# Altium schematic sheet Indicator Light.SchDoc
size Tabloid; SheetNumber: 4; SheetTotal: 5
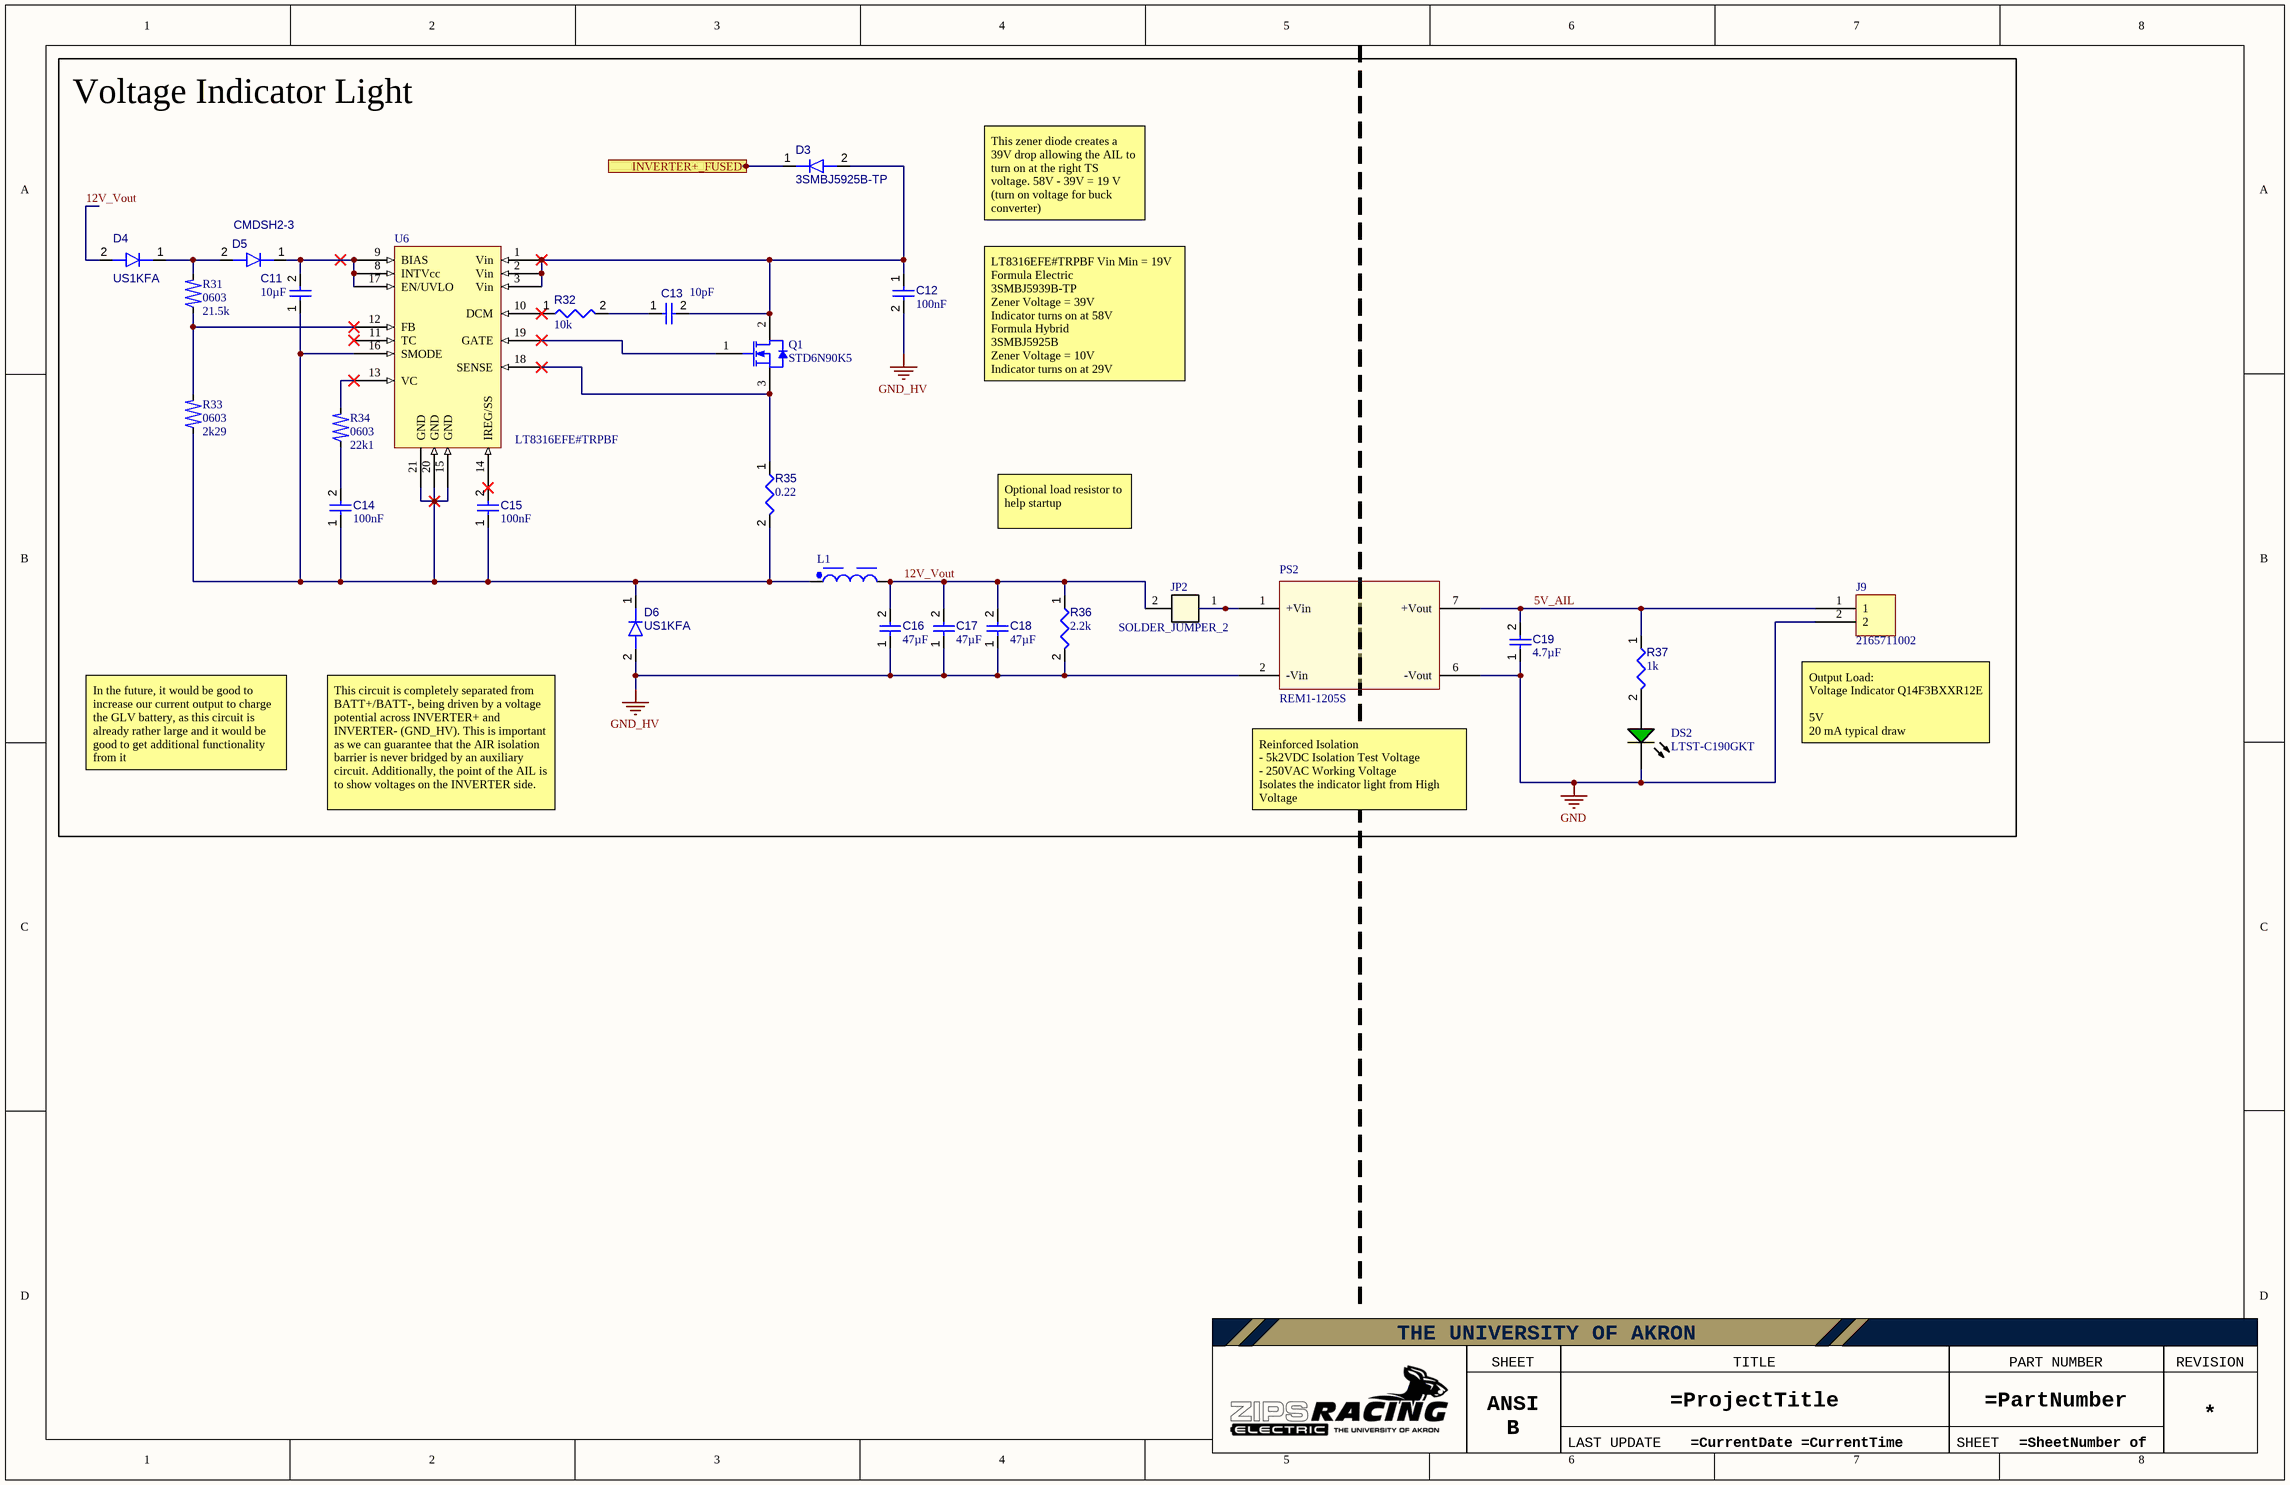
[diagram p0: Indicator Light.SchDoc]

## Parts
C11  value 10µF  [CAPC0805(2012)145_L]  (hidden comment: Capacitor 10µF +/-20% 25V 0805)
C12  value 100nF  [FP-GCJ55D-0_4-MFG]  (hidden comment: C1812C104KDRAC7800)
C13  value 10pF  [C1206C100FGGAC7800-Footprint-1]  (hidden comment: C1206C100FGGAC7800)
C14  value 100nF  [CAPC1608X90X40NL10T20]  (hidden comment: Capacitor 100 nF +/-10% 50 V 0603)
C15  value 100nF  [CAPC1608X90X40NL10T20]  (hidden comment: Capacitor 100 nF +/-10% 50 V 0603)
C16  value 47µF  [CAPC0805(2012)145_L]  (hidden comment: Capacitor 47µF +/-40% 6.3V 0805)
C17  value 47µF  [CAPC0805(2012)145_L]  (hidden comment: Capacitor 47µF +/-40% 6.3V 0805)
C18  value 47µF  [CAPC0805(2012)145_L]  (hidden comment: Capacitor 47µF +/-40% 6.3V 0805)
C19  value 4.7µF  [CAPC0805(2012)145_L]  (hidden comment: Capacitor 4.7µF +/-40% 25V 0805)
D3  3SMBJ5925B-TP  [SMBJ15A-Footprint-1]
D4  US1KFA  [DIOM2818X14N]
D5  CMDSH2-3  [CMDSH2-3-Footprint-1]
D6  US1KFA  [DIOM2818X14N]
DS2  LTST-C190GKT  [LTST-C190GKT_V]
J9  2165711002  [FP-216571-1002-MFG]
JP2  SOLDER_JUMPER_2  [C0603_JUMPER]  (no BOM)
L1  7687714102  [WE-PD HV_1060]  (value not drawn)
PS2  REM1-1205S  [REM1-1205S-Footprint-1]
Q1  STD6N90K5  [STD6N90K5-Footprint-1]
R31  value 21.5k  Footprint: 0603  [RES-0603-Generic]  (hidden comment: Resistor 21k5 0603 1%)
R32  value 10k  [RESC1608X55X25ML10T15]  (hidden comment: Resistor 10k +/-1% 0603 100 mW)
R33  value 2k29  Footprint: 0603  [RES-0603-Generic]  (hidden comment: Resistor 2k49 0603 1%)
R34  value 22k1  Footprint: 0603  [RES-0603-Generic]  (hidden comment: Resistor 22k1 0603 1%)
R35  value 0.22  [RESC3216X70X50NL05T20]  (hidden comment: ERJ-8BQFR22V)
R36  value 2.2k  [RESC1608X55X25LL10T15]  (hidden comment: Resistor 2.2k +/-1% 0603 100mW)
R37  value 1k  [RESC1608X55X25ML10T15]  (hidden comment: Resistor 1k +/-1% 0603 100 mW)
U6  LT8316EFE#TRPBF  [LT8316EFE#TRPBF-Footprint-1]

## Blocks framed on the sheet
Voltage Indicator Light: C11-C19 D3-D6 DS2 J9 JP2 L1 PS2 Q1 R31-R37 U6

## Ports
INVERTER+_FUSED (in, see Main[4C], High Voltage[1A], TS Precharge and TSAL[1A])

## Nets
GND: C19.1 DS2.2(K) J9.2 PS2.6(-Vout)
GND_HV: C12.2 C16.1 C17.1 C18.1 D6.2(A) PS2.2(-Vin) R36.2
5V_AIL: C19.2 J9.1 PS2.7(+Vout) R37.1
12V_Vout: C16.2 C17.2 C18.2 D4.2(A) JP2.2 L1.2 R36.1
INVERTER+_FUSED: D3.1(K) ; port INVERTER+_FUSED
NetC11_1: C11.1 C14.1 C15.1 D6.1(K) L1.1 R33.1 R35.2 U6.15(GND) U6.16(SMODE) U6.20(GND) U6.21(GND)
NetC11_2: C11.2 D5.1(K) U6.8(INTVcc) U6.9(BIAS) U6.17(EN/UVLO)
NetC12_1: C12.1 C13.2 D3.2(A) Q1.2(D) U6.1(Vin) U6.2(Vin) U6.3(Vin)
NetC13_1: C13.1 R32.2
NetC14_2: C14.2 R34.1
NetC15_2: C15.2 U6.14(IREG/SS)
NetD4_1: D4.1(K) D5.2(A) R31.2
NetDS2_1: DS2.1(A) R37.2
NetJP2_1: JP2.1 PS2.1(+Vin)
NetQ1_1: Q1.1(G) U6.19(GATE)
NetQ1_3: Q1.3(S) R35.1 U6.18(SENSE)
NetR31_1: R31.1 R33.2 U6.12(FB)
NetR32_1: R32.1 U6.10(DCM)
NetR34_2: R34.2 U6.13(VC)

Not connected (* = marked no-connect by the designer): PS2 3(NC) 4(NC) 5(NC); U6 11(TC)*

## Notes on the sheet
- This zener diode creates a 39V drop allowing the AIL to turn on at the right TS voltage. 58V - 39V = 19 V (turn on voltage for buck converter)
- LT8316EFE#TRPBF Vin Min = 19V
  Formula Electric
  3SMBJ5939B-TP
  Zener Voltage = 39V
  Indicator turns on at 58V
  Formula Hybrid
  3SMBJ5925B
  Zener Voltage = 10V
  Indicator turns on at 29V
- Optional load resistor to help startup
- In the future, it would be good to increase our current output to charge the GLV battery, as this circuit is already rather large and it would be good to get additional functionality from it
- (near J9) Output Load:
  Voltage Indicator Q14F3BXXR12E
  5V
  20 mA typical draw
- This circuit is completely separated from BATT+/BATT-, being driven by a voltage potential across INVERTER+ and INVERTER- (GND_HV). This is important as we can guarantee that the AIR isolation barrier is never bridged by an auxiliary circuit. Additionally, the point of the AIL is to show voltages on the INVERTER side.
- Reinforced Isolation
  - 5k2VDC Isolation Test Voltage
  - 250VAC Working Voltage
  Isolates the indicator light from High Voltage
- THE UNIVERSITY OF AKRON
- SHEET SIZE
- TITLE
- PART NUMBER
- REVISION
- ANSI B
- LAST UPDATE
- SHEET

## Library data of the parts
C11 = CMP-001-00079-4: Chip Capacitor, 10µF +/-20%, 25V, 0805, Thickness 1.45 mm; Tolerance: 10%; Max Operating Temperature: 85°C; Case/Package: 0805; Voltage Rating: 25V; Min Operating Temperature: -55°C; Mounting Technology: SMT; Pins: 2
C12 = CMP-001-00116-1: Ceramic Capacitor, Multilayer, Ceramic, 1000V, 10% +Tol, 10% -Tol, X7R, 15% TC, 0.1uF, Surface Mount, 2220; Rated DC Voltage (URdc): 1kV; Height: 2mm; Length: 5.7mm; Max Operating Temperature: 125°C; Pins: 2; Capacitor Type: Ceramic; RoHS Compliant: Yes; Mounting Technology: Surface Mount; Dielectric Material: Ceramic; Case/Package: 2220; Min Operating Temperature: -55°C
C13 = CMP-001-00115-2: CAP CER SMD 1206 10PF 2KV 1% COG; Capacitor Type: Ceramic; Max Operating Temperature: 125°C; Case/Package: 1206; Min Operating Temperature: -50°C; Tolerance: 1%; Voltage Rating: 2kV; Mounting Technology: SMT
C14 C15 = CMP-001-00017-6: Chip Capacitor, 100 nF, +/- 10%, 50 V, 0603 (1608 Metric); Voltage Rating: 50V; Capacitor Type: Ceramic; Tolerance: 10%; Mounting Technology: SM; Max Operating Temperature: 125°C; RoHS Compliant: True; Pins: 2; Case/Package: 0603; Min Operating Temperature: -55°C
C16-C18 = CMP-001-00082-4: Chip Capacitor, 47µF +/-40%, 6.3V, 0805, Thickness 1.45 mm; Tolerance: 10%; Min Operating Temperature: -55°C; Max Operating Temperature: 85°C; Case/Package: 0805; Pins: 2; Mounting Technology: SMT; Voltage Rating: 6.3V
C19 = CMP-001-00080-4: Chip Capacitor, 4.7µF +/-40%, 25V, 0805, Thickness 1.45 mm; Tolerance: 20%; Voltage Rating: 25V; Min Operating Temperature: -55°C; Max Operating Temperature: 85°C; Pins: 2; Mounting Technology: SMT; Case/Package: 0805
D3 = CMP-004-00064-1: Diode Zener 10V 3W DO214AA; RoHS Compliant: Yes; Max Operating Temperature: 150°C; Min Operating Temperature: -55°C; Diode Type: ZENER; Pins: 2
D4 D6 = CMP-004-00061-1: Rectifier Diode, 1 Phase, 1 Element, 1A, 800V V(RRM), Silicon; RoHS Compliant: Yes; Diode Type: RECTIFIER; Diode Element Material: SILICON; Min Operating Temperature: -55°C; Pins: 2; JESD-30 Code: R-PDSO-F2; Max Operating Temperature: 150°C
D5 = CMP-004-00062-2: Rectifier Diode, Schottky, 1 Phase, 1 Element, 0.2A, 30V V(RRM), Silicon; Forward Voltage: 550mV; Diode Element Material: SILICON; RoHS Compliant: Yes; Min Operating Temperature: -65°C; Pins: 2; Diode Type: RECTIFIER; Max Operating Temperature: 150°C
DS2 = CMP-007-00022-2: LED Uni-Color Green, 100 mW, 30 mA, -55 to 85 degC, 2-Pin SMD, RoHS, Tape and Reel; Manufacturer: Lite-On; Power: 100mW; Forward Voltage: 2.1V; Viewing Angle: 130degrees; Forward Current: 20mA; Luminous Intensity: 6mcd; Lens Style: Clear; Manufacturer URL: http://www.us.liteon.com/; RoHS Compliant: True; Colour: Green; Package Description: 2-Pin Surface Mount Device, Body 1.6 x 0.8 mm; Datasheet URL: http://datasheet.octopart.com/LTST-C190GKT-Lite-On-datasheet-158530.pdf; Datasheet Version: Dec-06; Mounting Technology: SM; Case/Package: 0603; Package Reference: C190GKT; Packaging: TapeandReel; Min Operating Temperature: -55°C; Nominal Vf: 2.1V; Package Quantity: 3000; Illumination Colour: Green; Max Operating Temperature: 85°C; Pins: 2
J9 = CMP-002-00115-1: Micro-Fit+ Vertical Header, Through Hole, 3.00mm Pitch, Single Row, 2 Circuits, Matte Tin (Sn) Plating, Glow-Wire Capable, Black; Max Current Rating: 12.5A; Voltage Rating: 600V; Gender: Male; Rows: 1; Connector Type: PCB Header; Min Operating Temperature: -40°C; Pins: 2; ComponentLink1Description: Datasheet; ComponentLink1URL: https://www.molex.com/en-us/products/part-detail/2165711002?display=pdf; Mounting Technology: Thru-hole; Max Operating Temperature: 105°C
JP2 = CMP-023-000020-4: 2 position solder jumper, no BOM; Source: Zips_Racing_Electric.SchLib; Design Item ID: SOLDER_JUMPER_2
L1 = CMP-006-00027-1: General Purpose Inductor, 1000uH, 20%, 1 Element, SMD; Inductor Application: POWER INDUCTOR; Max Current Rating: 400mA; DC Resistance (DCR): 3.2R; Self Resonant Frequency: 1.7MHz; Tolerance: 20%; Inductance-Nom (L): 1000uH; Max Operating Temperature: 125°C; Inductor Type: GENERAL PURPOSE INDUCTOR; RoHS Compliant: Yes; Pins: 2; Min Operating Temperature: -40°C; Surface Mount: Yes
PS2 = CMP-019-00059-2: DC-DC Unregulated Power Supply Module, 1 Output, 1W, Hybrid; Reach SVHC Compliant: Yes; RoHS Compliant: Yes; Throw Configuration: DC-DC UNREGULATED POWER SUPPLY MODULE
Q1 = CMP-013-00036-1: N-Channel 900 V 6A (Tc) 110W (Tc) Surface Mount DPAK; Min Operating Temperature: -55°C; Case/Package: DPAK; Max Operating Temperature: 150°C; RoHS Compliant: Yes
R31 = CMP-00027-1: Resistor, 0603, 1%, 1/10W; Power: 100mW; Datasheet: https://www.seielect.com/catalog/sei-rmcf_rmcp.pdf; Max Operating Temperature: 155°C; Tolerance: 1%; Min Operating Temperature: -55°C
R32 = CMP-009-00017-5: Chip Resistor, 10 KOhm, +/- 1%, 01 W, -55 to 155 degC, 0603 (1608 Metric); Voltage Rating: 50V; Power: 100mW; RoHS Compliant: True; Min Operating Temperature: -55°C; Pins: 2; Case/Package: 0603; Mounting Technology: SM; Max Operating Temperature: 155°C; Tolerance: 1%
R33 = CMP-00028-1: Resistor, 0603, 1%, 1/10W; Power: 100mW; Max Operating Temperature: 155°C; Min Operating Temperature: -55°C; Tolerance: 1%; Datasheet: https://www.seielect.com/catalog/sei-rmcf_rmcp.pdf
R34 = CMP-00029-1: Resistor, 0603, 1%, 1/10W; Power: 100mW; Tolerance: 1%; Datasheet: https://www.seielect.com/catalog/sei-rmcf_rmcp.pdf; Max Operating Temperature: 155°C; Min Operating Temperature: -55°C
R35 = CMP-009-00286-1: Fixed Resistor, Metal Glaze/thick Film, 0.5W, 0.22ohm, 0.3317V, 1% +/-Tol, 0,250ppm/Cel, Surface Mount, 1206; Power: 500mW; Min Operating Temperature: -55°C; Pins: 2; Max Operating Temperature: 125°C; RoHS Compliant: Yes; Tolerance: 1%; Mounting Technology: Surface Mount; Case/Package: 1206
R36 = CMP-009-00198-1: Description Chip Resistor, 2.2 KOhm, +/-1%, 0.1 W, -55 to 155 degC, 0603 (1608 Metric); Temperature Coefficient: 100ppm/°C; Rated Temperature: 70°C; Tolerance: 1%; Working Voltage: 75V; Case/Package: 0603; Power: 100mW; Mounting Technology: Surface Mount; Min Operating Temperature: -55°C; Max Operating Temperature: 155°C; RoHS Compliant: Yes; Pins: 2
R37 = CMP-009-00014-5: Chip Resistor, 1 KOhm, +/-1%, 0.1 W, -55 to 155 degC, 0603 (1608 Metric); Voltage Rating: 50V; Power: 100mW; Tolerance: 1%; Mounting Technology: SM; Pins: 2; Case/Package: 0603; Min Operating Temperature: -55°C; RoHS Compliant: True; Max Operating Temperature: 155°C
U6 = CMP-031-00006-6: Switching Controller, Current-mode, 142kHz Switching Freq-Max, PDSO16; Max Supply Voltage: 600V; Min Supply Voltage: 16V; Min Operating Temperature: -40°C; Max Operating Temperature: 125°C; Pins: 20; Case/Package: 20(16)-Lead TSSOP; Mounting Technology: SMD